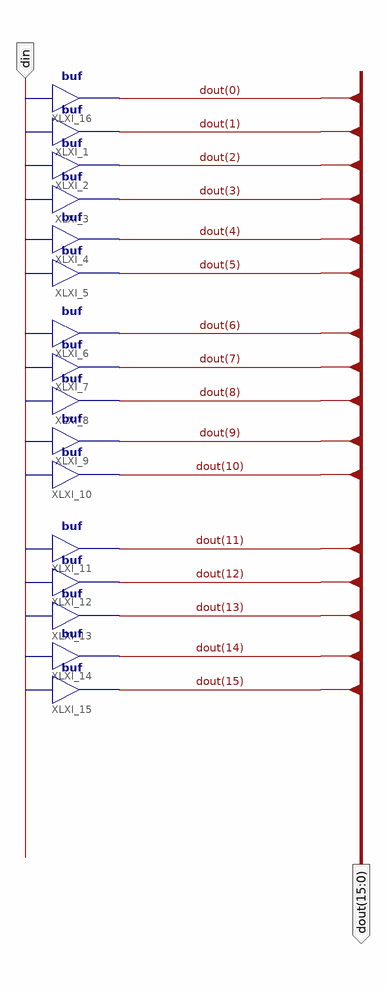
[diagram p0: schematic sheet 1]
// Xilinx ISE schematic broadcast.sch (spartan6) as structural Verilog: 16 symbols, 2 ports
module broadcast (
  input  din,
  output [15:0] dout
);

  buf XLXI_1 (dout[1], din);
  buf XLXI_2 (dout[2], din);
  buf XLXI_3 (dout[3], din);
  buf XLXI_4 (dout[4], din);
  buf XLXI_5 (dout[5], din);
  buf XLXI_6 (dout[6], din);
  buf XLXI_7 (dout[7], din);
  buf XLXI_8 (dout[8], din);
  buf XLXI_9 (dout[9], din);
  buf XLXI_10 (dout[10], din);
  buf XLXI_11 (dout[11], din);
  buf XLXI_12 (dout[12], din);
  buf XLXI_13 (dout[13], din);
  buf XLXI_14 (dout[14], din);
  buf XLXI_15 (dout[15], din);
  buf XLXI_16 (dout[0], din);
endmodule
